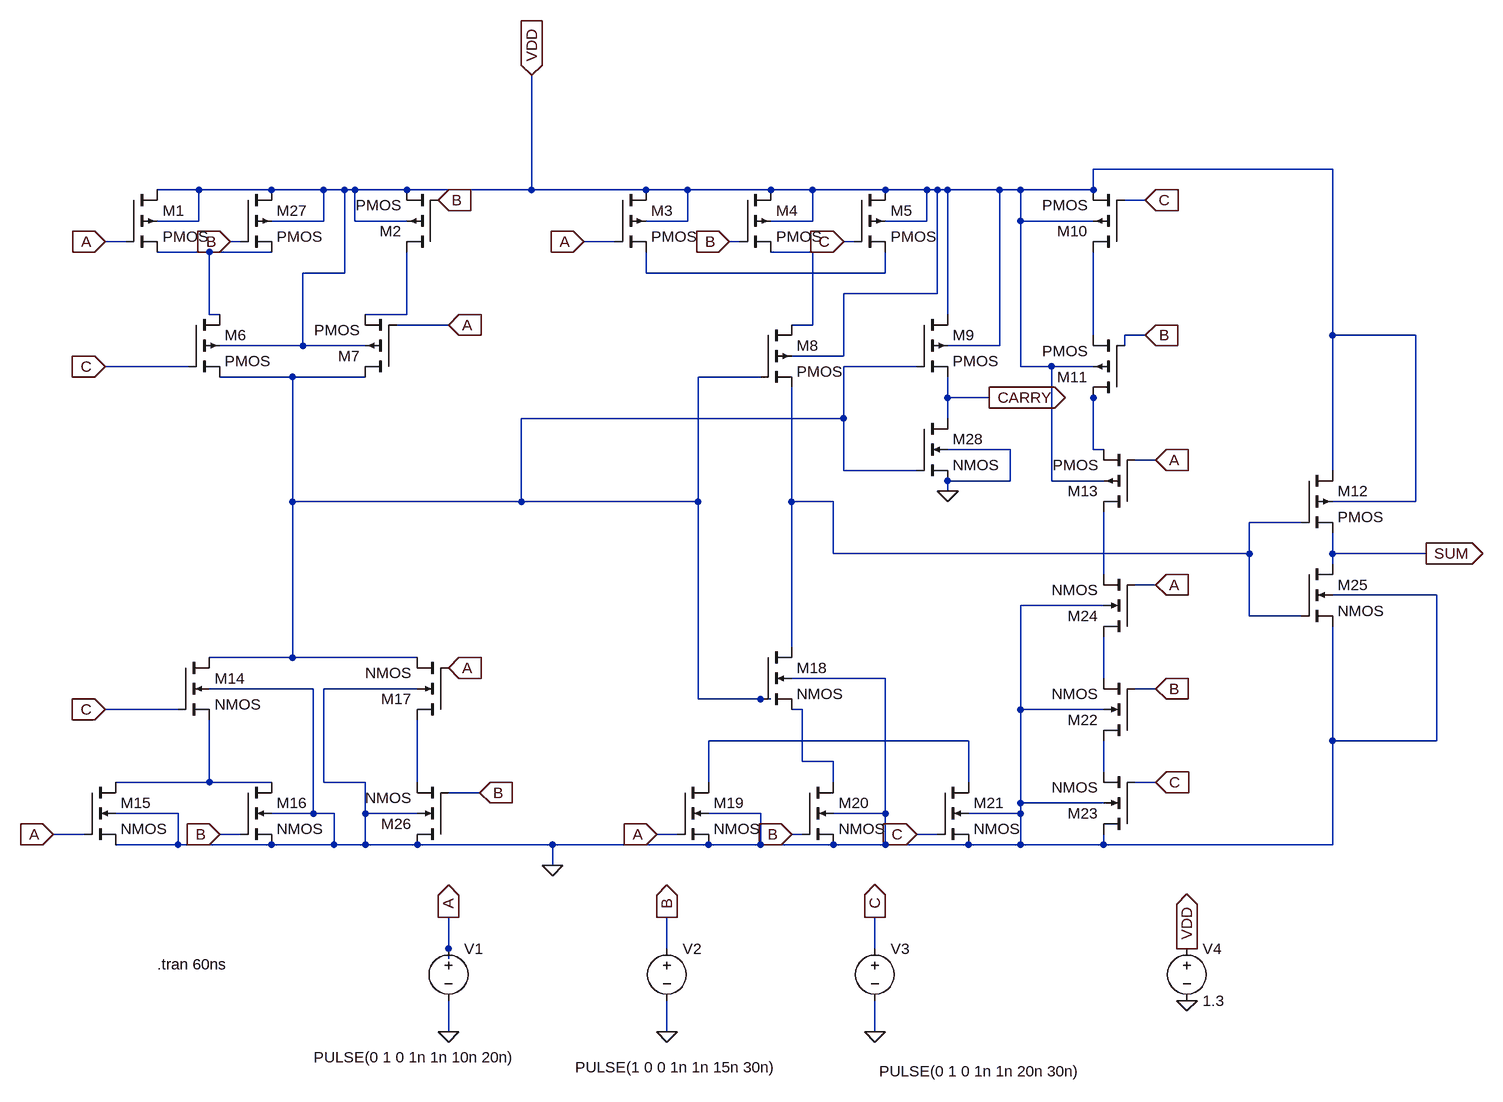
[diagram p0: schematic cmos full adder.asc]
cmos full adder.asc, the LTspice schematic file:
Version 4
SHEET 1 3216 4104
WIRE 1984 96 1616 96
WIRE 240 128 176 128
WIRE 352 128 240 128
WIRE 432 128 352 128
WIRE 464 128 432 128
WIRE 480 128 464 128
WIRE 560 128 480 128
WIRE 752 128 752 -48
WIRE 752 128 560 128
WIRE 928 128 752 128
WIRE 992 128 928 128
WIRE 1120 128 992 128
WIRE 1184 128 1120 128
WIRE 1296 128 1184 128
WIRE 1360 128 1296 128
WIRE 1376 128 1360 128
WIRE 1392 128 1376 128
WIRE 1472 128 1392 128
WIRE 1504 128 1472 128
WIRE 1616 128 1616 96
WIRE 1616 128 1504 128
WIRE 1696 144 1664 144
WIRE 240 176 240 128
WIRE 240 176 176 176
WIRE 432 176 432 128
WIRE 432 176 352 176
WIRE 480 176 480 128
WIRE 560 176 480 176
WIRE 992 176 992 128
WIRE 992 176 928 176
WIRE 1184 176 1184 128
WIRE 1184 176 1120 176
WIRE 1360 176 1360 128
WIRE 1360 176 1296 176
WIRE 1504 176 1504 128
WIRE 1616 176 1504 176
WIRE 128 208 96 208
WIRE 304 208 288 208
WIRE 880 208 832 208
WIRE 1072 208 1056 208
WIRE 1248 208 1232 208
WIRE 256 224 176 224
WIRE 352 224 256 224
WIRE 1184 224 1120 224
WIRE 464 256 464 128
WIRE 464 256 400 256
WIRE 928 256 928 224
WIRE 1296 256 1296 224
WIRE 1296 256 928 256
WIRE 1376 288 1376 128
WIRE 1376 288 1232 288
WIRE 256 320 256 224
WIRE 272 320 256 320
WIRE 560 320 560 224
WIRE 560 320 496 320
WIRE 1392 320 1392 128
WIRE 624 336 544 336
WIRE 1184 336 1184 224
WIRE 1184 336 1152 336
WIRE 1616 352 1616 224
WIRE 1696 352 1664 352
WIRE 1984 352 1984 96
WIRE 2112 352 1984 352
WIRE 400 368 400 256
WIRE 400 368 272 368
WIRE 496 368 400 368
WIRE 1472 368 1472 128
WIRE 1472 368 1392 368
WIRE 1664 368 1664 352
WIRE 1232 384 1232 288
WIRE 1232 384 1152 384
WIRE 224 400 96 400
WIRE 1344 400 1232 400
WIRE 1504 400 1504 176
WIRE 1552 400 1504 400
WIRE 1616 400 1552 400
WIRE 384 416 272 416
WIRE 496 416 384 416
WIRE 1104 416 1008 416
WIRE 1392 448 1392 416
WIRE 1456 448 1392 448
WIRE 1616 448 1616 432
WIRE 1232 480 1232 400
WIRE 1232 480 736 480
WIRE 1392 480 1392 448
WIRE 1488 528 1392 528
WIRE 1616 528 1616 448
WIRE 1632 528 1616 528
WIRE 1712 544 1680 544
WIRE 1232 560 1232 480
WIRE 1344 560 1232 560
WIRE 1984 560 1984 352
WIRE 1488 576 1488 528
WIRE 1488 576 1392 576
WIRE 1552 576 1552 400
WIRE 1632 576 1552 576
WIRE 1392 592 1392 576
WIRE 384 608 384 416
WIRE 736 608 736 480
WIRE 736 608 384 608
WIRE 1008 608 1008 416
WIRE 1008 608 736 608
WIRE 1152 608 1152 432
WIRE 1216 608 1152 608
WIRE 2112 608 2112 352
WIRE 2112 608 1984 608
WIRE 1936 640 1856 640
WIRE 1216 688 1216 608
WIRE 1856 688 1856 640
WIRE 1856 688 1216 688
WIRE 1984 688 1984 656
WIRE 2128 688 1984 688
WIRE 1984 704 1984 688
WIRE 1632 720 1632 624
WIRE 1712 736 1680 736
WIRE 2144 752 1984 752
WIRE 1632 768 1504 768
WIRE 1856 784 1856 688
WIRE 1936 784 1856 784
WIRE 1152 832 1152 608
WIRE 384 848 384 608
WIRE 384 848 256 848
WIRE 576 848 384 848
WIRE 1296 880 1152 880
WIRE 1632 880 1632 816
WIRE 416 896 256 896
WIRE 576 896 432 896
WIRE 1712 896 1680 896
WIRE 1008 912 1008 608
WIRE 1104 912 1008 912
WIRE 1120 912 1104 912
WIRE 208 928 96 928
WIRE 1168 928 1152 928
WIRE 1504 928 1504 768
WIRE 1632 928 1504 928
WIRE 1424 976 1024 976
WIRE 1984 976 1984 800
WIRE 2144 976 2144 752
WIRE 2144 976 1984 976
WIRE 1168 1008 1168 928
WIRE 1216 1008 1168 1008
WIRE 1632 1024 1632 976
WIRE 256 1040 256 944
WIRE 256 1040 112 1040
WIRE 352 1040 256 1040
WIRE 432 1040 432 896
WIRE 496 1040 432 1040
WIRE 576 1040 576 944
WIRE 1024 1040 1024 976
WIRE 1216 1040 1216 1008
WIRE 1424 1040 1424 976
WIRE 1712 1040 1680 1040
WIRE 672 1056 624 1056
WIRE 1504 1072 1504 928
WIRE 1632 1072 1504 1072
WIRE 208 1088 112 1088
WIRE 416 1088 416 896
WIRE 416 1088 352 1088
WIRE 448 1088 416 1088
WIRE 496 1088 496 1040
WIRE 576 1088 496 1088
WIRE 1104 1088 1024 1088
WIRE 1296 1088 1296 880
WIRE 1296 1088 1216 1088
WIRE 1504 1088 1504 1072
WIRE 1504 1088 1424 1088
WIRE 64 1120 16 1120
WIRE 304 1120 272 1120
WIRE 976 1120 944 1120
WIRE 1168 1120 1152 1120
WIRE 1376 1120 1344 1120
WIRE 208 1136 208 1088
WIRE 208 1136 112 1136
WIRE 352 1136 208 1136
WIRE 448 1136 448 1088
WIRE 448 1136 352 1136
WIRE 496 1136 496 1088
WIRE 496 1136 448 1136
WIRE 576 1136 496 1136
WIRE 784 1136 576 1136
WIRE 1024 1136 784 1136
WIRE 1104 1136 1104 1088
WIRE 1104 1136 1024 1136
WIRE 1216 1136 1104 1136
WIRE 1296 1136 1296 1088
WIRE 1296 1136 1216 1136
WIRE 1424 1136 1296 1136
WIRE 1504 1136 1504 1088
WIRE 1504 1136 1424 1136
WIRE 1632 1136 1632 1120
WIRE 1632 1136 1504 1136
WIRE 1984 1136 1984 976
WIRE 1984 1136 1632 1136
WIRE 784 1168 784 1136
WIRE 624 1296 624 1248
WIRE 960 1296 960 1248
WIRE 1280 1296 1280 1248
WIRE 624 1312 624 1296
WIRE 624 1424 624 1376
WIRE 960 1424 960 1376
WIRE 1280 1424 1280 1376
FLAG 752 -48 VDD
IOPIN 752 -48 In
FLAG 96 208 A
IOPIN 96 208 In
FLAG 96 400 C
IOPIN 96 400 In
FLAG 288 208 B
IOPIN 288 208 In
FLAG 608 144 B
IOPIN 608 144 In
FLAG 96 928 C
IOPIN 96 928 In
FLAG 624 864 A
IOPIN 624 864 In
FLAG 16 1120 A
IOPIN 16 1120 In
FLAG 272 1120 B
IOPIN 272 1120 In
FLAG 672 1056 B
IOPIN 672 1056 In
FLAG 944 1120 A
IOPIN 944 1120 In
FLAG 1152 1120 B
IOPIN 1152 1120 In
FLAG 832 208 A
IOPIN 832 208 In
FLAG 1056 208 B
IOPIN 1056 208 In
FLAG 1232 208 C
IOPIN 1232 208 In
FLAG 1696 144 C
IOPIN 1696 144 In
FLAG 1696 352 B
IOPIN 1696 352 In
FLAG 1712 544 A
IOPIN 1712 544 In
FLAG 1712 736 A
IOPIN 1712 736 In
FLAG 1712 896 B
IOPIN 1712 896 In
FLAG 1712 1040 C
IOPIN 1712 1040 In
FLAG 624 1248 A
IOPIN 624 1248 Out
FLAG 624 1424 0
FLAG 960 1424 0
FLAG 1280 1424 0
FLAG 960 1248 B
IOPIN 960 1248 Out
FLAG 1280 1248 C
IOPIN 1280 1248 Out
FLAG 1392 592 0
FLAG 784 1168 0
FLAG 2128 688 SUM
IOPIN 2128 688 Out
FLAG 1456 448 CARRY
IOPIN 1456 448 Out
FLAG 1344 1120 C
IOPIN 1344 1120 In
FLAG 1760 1296 VDD
IOPIN 1760 1296 Out
FLAG 1760 1376 0
FLAG 624 336 A
IOPIN 624 336 In
SYMBOL voltage 624 1280 R0
WINDOW 3 -207 183 Left 2
SYMATTR Value PULSE(0 1 0 1n 1n 10n 20n)
SYMATTR InstName V1
SYMBOL voltage 960 1280 R0
WINDOW 3 -141 199 Left 2
SYMATTR Value PULSE(1 0 0 1n 1n 15n 30n)
SYMATTR InstName V2
SYMBOL voltage 1280 1280 R0
WINDOW 3 7 205 Left 2
SYMATTR Value PULSE(0 1 0 1n 1n 20n 30n)
SYMATTR InstName V3
SYMBOL voltage 1760 1280 R0
SYMATTR InstName V4
SYMATTR Value 1.3
SYMBOL pmos4 128 128 R0
SYMATTR InstName M1
SYMBOL pmos4 608 224 R180
SYMATTR InstName M2
SYMBOL pmos4 880 128 R0
SYMATTR InstName M3
SYMBOL pmos4 1072 128 R0
SYMATTR InstName M4
SYMBOL pmos4 1248 128 R0
SYMATTR InstName M5
SYMBOL pmos4 224 320 R0
SYMATTR InstName M6
SYMBOL pmos4 544 416 R180
SYMATTR InstName M7
SYMBOL pmos4 1104 336 R0
SYMATTR InstName M8
SYMBOL pmos4 1344 320 R0
SYMATTR InstName M9
SYMBOL pmos4 1936 560 R0
SYMATTR InstName M12
SYMBOL pmos4 1664 224 R180
SYMATTR InstName M10
SYMBOL pmos4 1664 448 R180
SYMATTR InstName M11
SYMBOL pmos4 1680 624 R180
SYMATTR InstName M13
SYMBOL nmos4 208 848 R0
SYMATTR InstName M14
SYMBOL nmos4 64 1040 R0
SYMATTR InstName M15
SYMBOL nmos4 304 1040 R0
SYMATTR InstName M16
SYMBOL nmos4 624 944 R180
SYMATTR InstName M17
SYMBOL nmos4 1104 832 R0
SYMATTR InstName M18
SYMBOL nmos4 976 1040 R0
SYMATTR InstName M19
SYMBOL nmos4 1168 1040 R0
SYMATTR InstName M20
SYMBOL nmos4 1376 1040 R0
SYMATTR InstName M21
SYMBOL nmos4 1680 976 R180
SYMATTR InstName M22
SYMBOL nmos4 1680 1120 R180
SYMATTR InstName M23
SYMBOL nmos4 1680 816 R180
SYMATTR InstName M24
SYMBOL nmos4 1936 704 R0
SYMATTR InstName M25
SYMBOL nmos4 624 1136 R180
SYMATTR InstName M26
SYMBOL pmos4 304 128 R0
SYMATTR InstName M27
SYMBOL nmos4 1344 480 R0
SYMATTR InstName M28
TEXT 176 1320 Left 2 !.tran 60ns

The netlist it stands for:
* cmos full adder.asc
V1 A 0 PULSE(0 1 0 1n 1n 10n 20n)
V2 B 0 PULSE(1 0 0 1n 1n 15n 30n)
V3 C 0 PULSE(0 1 0 1n 1n 20n 30n)
V4 VDD 0 1.3
M1 VDD A N001 VDD PMOS
M2 N004 B VDD VDD PMOS
M3 VDD A N003 VDD PMOS
M4 VDD B N002 VDD PMOS
M5 VDD C N003 VDD PMOS
M6 N001 C N006 VDD PMOS
M7 N006 A N004 VDD PMOS
M8 N002 N006 N008 VDD PMOS
M9 VDD N006 CARRY VDD PMOS
M12 VDD N008 SUM VDD PMOS
M10 N005 C VDD VDD PMOS
M11 N007 B N005 VDD PMOS
M13 N009 A N007 VDD PMOS
M14 N006 C N014 0 NMOS
M15 N014 A 0 0 NMOS
M16 N014 B 0 0 NMOS
M17 N015 A N006 0 NMOS
M18 N008 N006 N011 0 NMOS
M19 N012 A 0 0 NMOS
M20 N011 B 0 0 NMOS
M21 N012 C 0 0 NMOS
M22 N013 B N010 0 NMOS
M23 0 C N013 0 NMOS
M24 N010 A N009 0 NMOS
M25 SUM N008 0 0 NMOS
M26 0 B N015 0 NMOS
M27 VDD B N001 VDD PMOS
M28 CARRY N006 0 0 NMOS
.model NMOS NMOS
.model PMOS PMOS
.lib standard.mos
.tran 60ns
.backanno
.end